# EAGLE design ihc_mon_orig (EAGLE 6.5.0)
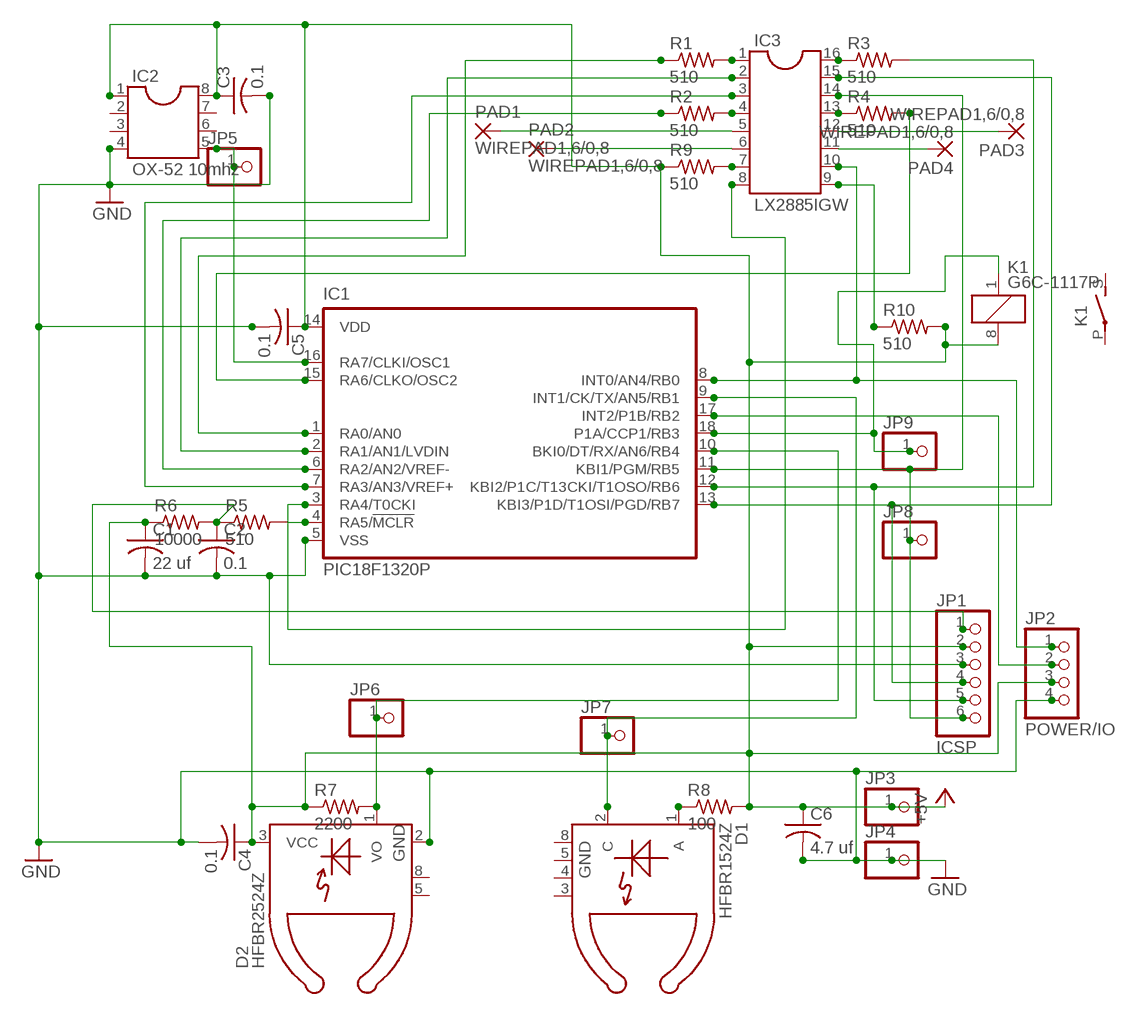
[diagram p0: schematic, sheet 1]

## Parts
C1  22 uf  C-US025-024X044  [C025-024X044]
C2  0.1  C-US050-025X075  [C050-025X075]
C3  0.1  C-US050-025X075  [C050-025X075]
C4  0.1  C-US050-025X075  [C050-025X075]
C5  0.1  C-US050-025X075  [C050-025X075]
C6  4.7 uf  C-US025-024X044  [C025-024X044]
D1  HFBR1524Z  HFBR1528  [HFBR25XX]
D2  HFBR2524Z  HFBR2528  [HFBR25XX]
IC1  PIC18F1320P  PIC18F1220P  [DIL18]
IC2  OX-52 10mhz  DIL8S  [SOCKET-08]
IC3  LX2885IGW  DIL16S  [SOCKET-16]
JP1  ICSP  PINHD-1X6  [1X06]
JP2  POWER/IO  PINHD-1X4  [1X04]
JP3  PINHD-1X1  [1X01]
JP4  PINHD-1X1  [1X01]
JP5  PINHD-1X1  [1X01]
JP6  PINHD-1X1  [1X01]
JP7  PINHD-1X1  [1X01]
JP8  PINHD-1X1  [1X01]
JP9  PINHD-1X1  [1X01]
K1  G6C-1117P  [G6C-1117P]
PAD1  WIREPAD1,6/0,8  [1,6/0,8]
PAD2  WIREPAD1,6/0,8  [1,6/0,8]
PAD3  WIREPAD1,6/0,8  [1,6/0,8]
PAD4  WIREPAD1,6/0,8  [1,6/0,8]
R1  510  R-US_0204/2V  [0204V]
R2  510  R-US_0204/2V  [0204V]
R3  510  R-US_0204/2V  [0204V]
R4  510  R-US_0204/2V  [0204V]
R5  510  R-US_0204/2V  [0204V]
R6  10000  R-US_0204/2V  [0204V]
R7  2200  R-US_0204/2V  [0204V]
R8  100  R-US_0204/2V  [0204V]
R9  510  R-US_0204/2V  [0204V]
R10  510  R-US_0204/2V  [0204V]

## Nets
+5V: C1.1 C3.1 C4.1 C5.1 C6.1 D2.3(VCC) IC1.14(VDD) IC2.1 IC2.8 JP1.2 JP2.3 JP3.1 K1.8 R6.1 R7.1 R8.2 R9.1 R10.2
GND: C1.2 C2.2 C3.2 C4.2 C5.2 C6.2 D2.2(GND) IC1.5(VSS) IC2.4 JP1.3 JP2.4 JP4.1
N$1: IC3.1 R1.2
N$2: IC3.4 R2.2
N$3: IC3.16 R3.1
N$4: IC3.13 R4.1
N$5: IC1.4(RA5/!MCLR) R5.2
N$6: C2.1 JP1.1 R5.1 R6.2
N$7: D2.1(VO) IC1.10(BKI0/DT/RX/AN6/RB4) JP6.1 R7.2
N$8: D1.1(A) R8.1
N$9: IC3.7 R9.2
N$10: IC1.18(P1A/CCP1/RB3) JP9.1 K1.1
N$11: IC1.8(INT0/AN4/RB0) IC3.10 JP2.1
N$12: IC3.9 R10.1
N$13: IC3.5 PAD1.1(P)
N$14: D1.2(C) IC1.9(INT1/CK/TX/AN5/RB1) JP7.1
N$15: IC1.11(KBI1/PGM/RB5) IC3.14 JP1.6 JP8.1
N$16: IC1.1(RA0/AN0) R1.1
N$17: IC1.2(RA1/AN1/LVDIN) IC3.2
N$18: IC1.6(RA2/AN2/VREF-) R2.1
N$19: IC1.7(RA3/AN3/VREF+) IC3.3
N$20: IC1.12(KBI2/P1C/T13CKI/T1OSO/RB6) JP1.5 R3.2
N$21: IC1.13(KBI3/P1D/T1OSI/PGD/RB7) IC3.15 JP1.4
N$22: IC1.15(RA6/CLKO/OSC2) R4.2
N$23: IC3.6 PAD2.1(P)
N$24: IC1.3(RA4/T0CKI) IC3.8
N$25: IC1.16(RA7/CLKI/OSC1) IC2.5 JP5.1
N$26: IC1.17(INT2/P1B/RB2) JP2.2
N$27: IC3.12 PAD3.1(P)
N$28: IC3.11 PAD4.1(P)
Unconnected: D1.3 D1.4 D1.5(GND) D1.8(GND) D2.5 D2.8 IC2.2 IC2.3 IC2.6 IC2.7 K1.P(2:P) K1.S(2:S)

## Library data of the parts
C1-C6 = resistor:C-US: CAPACITOR, American symbol
D1 = opto-transmittter-hp:HFBR1528: OPTO TRANSMITTER; MF: AGILENT TECHNOLOGIES; MPN: HFBR-1528; OC_FARNELL: 1247638; OC_NEWARK: 06F6056
D2 = opto-transmittter-hp:HFBR2528: OPTO RECEIVER; MF: AGILENT TECHNOLOGIES; MPN: HFBR-2528; OC_FARNELL: 1247664; OC_NEWARK: 06F6096
IC1 = microchip:PIC18F1*20: 18/20/28-Pin High-Performance, Enhanced Flash Microcontrollers with 10-bit A/D and nanoWatt Technology Source: ww1.microchip.com/downloads/en/DeviceDoc/39605c.pdf; MF: MICROCHIP; MPN: PIC18F1320-I/P; OC_FARNELL: 9761977; OC_NEWARK: 92C2429
IC2 = ic-package:DIL8: Dual In Line / Socket
IC3 = ic-package:DIL16: Dual In Line / Socket
JP1 = pinhead:PINHD-1X6: PIN HEADER
JP2 = pinhead:PINHD-1X4: PIN HEADER
JP3-JP9 = pinhead:PINHD-1X1: PIN HEADER
K1 = relay:G6C-1117P: RELAY 1 x norm. open, 10 A/240 V, Omron; OC_FARNELL: unknown; OC_NEWARK: unknown
PAD1-PAD4 = wirepad:WIREPAD: Wire PAD connect wire on PCB
R1-R10 = resistor:R-US_: RESISTOR, American symbol

## Board
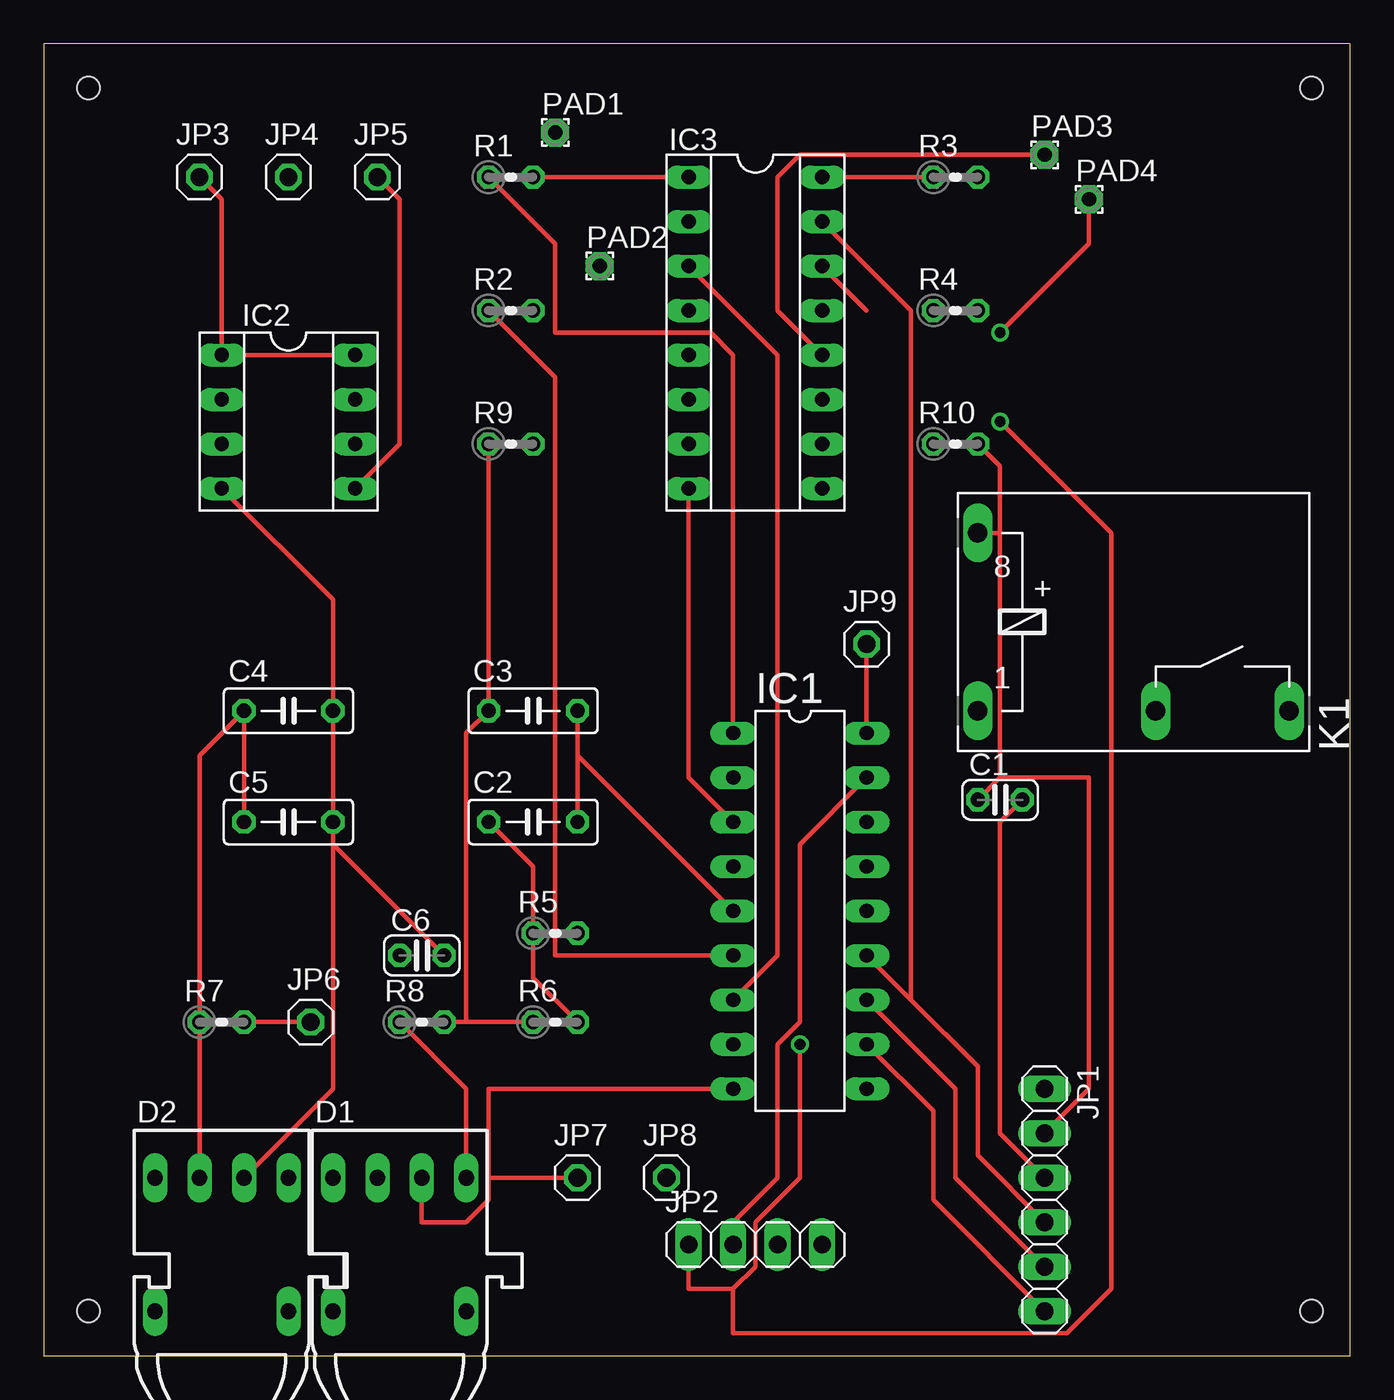
[diagram p1: board, top side]
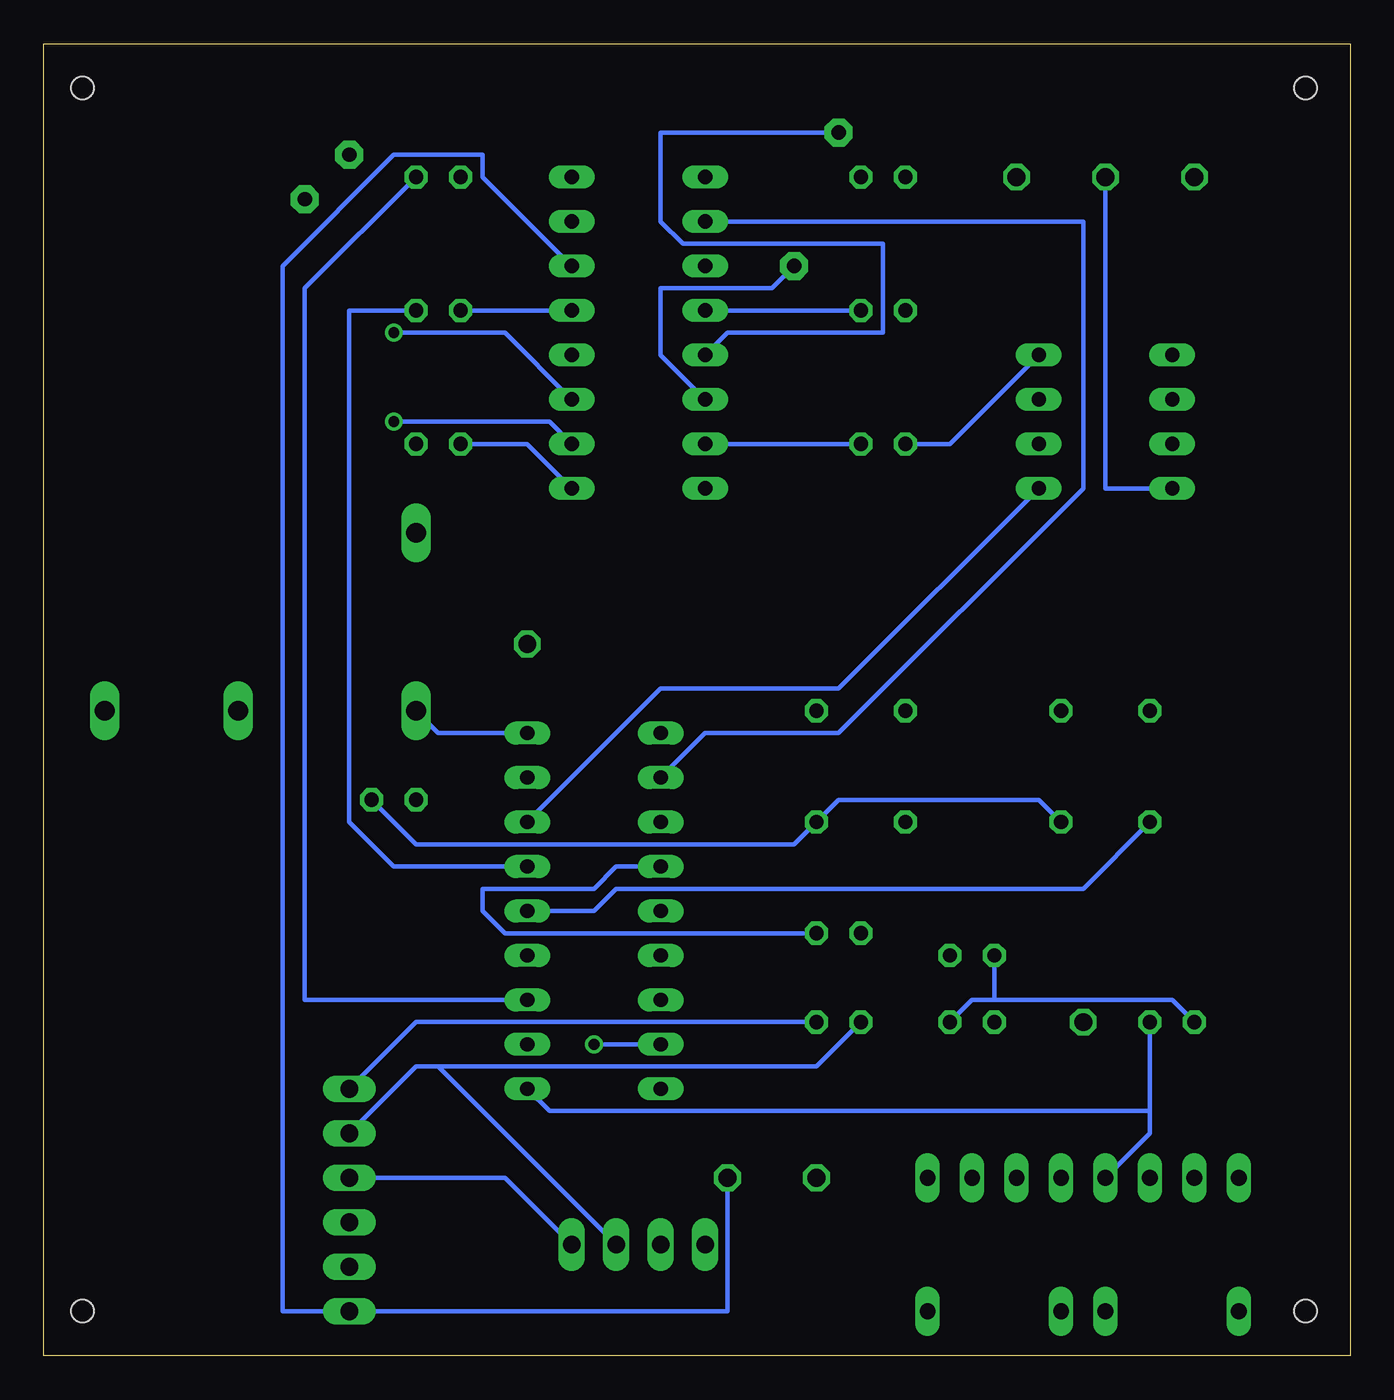
[diagram p2: board, bottom side, seen from below]

Size 74.6 x 74.92 mm. Coordinates in mm from the lower left corner, seen from the top.
Outline: 0,0 74.6,0 74.6,74.92 0,74.92 0,0
Copper layers (1*16): Top 0.035mm / dielectric 1.5mm / Bottom 0.035mm
Design rules "default": minimum track width 10mil, minimum drill 24mil, track to track 8mil, track to pad 8mil, pad to pad 8mil, via to via 8mil, smd to smd 8mil, copper to edge 40mil, drill to drill 8mil, minimum pad ring 10mil, minimum via ring 8mil, stop-mask expansion 4mil, vias tented up to drill 0mil, thermal gap 10mil
Holes 1.3 mm at 2.54,72.39 2.54,2.54 72.39,2.54 72.39,72.39

### Footprints (pad centres in the part's own frame; a part is rotated, then mirrored left to right if it is on the bottom)
C025-024X044 = drill 0.813 octagon: 1 -1.27,0; 2 1.27,0
C050-025X075 = drill 0.813 octagon: 1 -2.54,0; 2 2.54,0
HFBR25XX = drill 0.9 long: 1 0,3.81; 2 0,1.27; 3 0,-1.27; 4 0,-3.81; 5 7.62,-3.81; 8 7.62,3.81
DIL18 = drill 0.813 long: 1 -10.16,-3.81; 2 -7.62,-3.81; 3 -5.08,-3.81; 4 -2.54,-3.81; 5 0,-3.81; 6 2.54,-3.81; 7 5.08,-3.81; 8 7.62,-3.81; 9 10.16,-3.81; 10 10.16,3.81; 11 7.62,3.81; 12 5.08,3.81; 13 2.54,3.81; 14 0,3.81; 15 -2.54,3.81; 16 -5.08,3.81; 17 -7.62,3.81; 18 -10.16,3.81
SOCKET-08 = drill 0.813 long: 1 -3.81,-3.81; 2 -1.27,-3.81; 3 1.27,-3.81; 4 3.81,-3.81; 5 3.81,3.81; 6 1.27,3.81; 7 -1.27,3.81; 8 -3.81,3.81
SOCKET-16 = drill 0.813 long: 1 -8.89,-3.81; 2 -6.35,-3.81; 3 -3.81,-3.81; 4 -1.27,-3.81; 5 1.27,-3.81; 6 3.81,-3.81; 7 6.35,-3.81; 8 8.89,-3.81; 9 8.89,3.81; 10 6.35,3.81; 11 3.81,3.81; 12 1.27,3.81; 13 -1.27,3.81; 14 -3.81,3.81; 15 -6.35,3.81; 16 -8.89,3.81
1X06 = drill 1.016 long: 1 -6.35,0; 2 -3.81,0; 3 -1.27,0; 4 1.27,0; 5 3.81,0; 6 6.35,0
1X04 = drill 1.016 long: 1 -3.81,0; 2 -1.27,0; 3 1.27,0; 4 3.81,0
1X01 = drill 1.016 octagon: 1 0,0
G6C-1117P = drill 1.118 long: 1 -8.89,-5.08; 8 -8.89,5.08; P 1.27,-5.08; S 8.89,-5.08
1,6/0,8 = drill 0.813 pad 1.6 octagon: 1 0,0
0204V = drill 0.813 octagon: 1 -1.27,0; 2 1.27,0

### Placement (x,y rotation side)
C1  54.61,31.75 0 top
C2  27.94,30.48 0 top
C3  27.94,36.83 0 top
C4  13.97,36.83 0 top
C5  13.97,30.48 0 top
C6  21.59,22.86 0 top
D1  20.32,10.16 270 top
D2  10.16,10.16 270 top
IC1  43.18,25.4 270 top
IC2  13.97,53.34 270 top
IC3  40.64,58.42 270 top
JP1  57.15,8.89 270 top
JP2  40.64,6.35 0 top
JP3  8.89,67.31 0 top
JP4  13.97,67.31 0 top
JP5  19.05,67.31 0 top
JP6  15.24,19.05 0 top
JP7  30.48,10.16 0 top
JP8  35.56,10.16 0 top
JP9  46.99,40.64 0 top
K1  62.23,41.91 0 top
PAD1  29.21,69.85 0 top
PAD2  31.75,62.23 0 top
PAD3  57.15,68.58 0 top
PAD4  59.69,66.04 0 top
R1  26.67,67.31 0 top
R2  26.67,59.69 0 top
R3  52.07,67.31 0 top
R4  52.07,59.69 0 top
R5  29.21,24.13 0 top
R6  29.21,19.05 0 top
R7  10.16,19.05 0 top
R8  21.59,19.05 0 top
R9  26.67,52.07 0 top
R10  52.07,52.07 0 top

### Tracks (layer width: path | path; a pad name or v marks a point on that pad's centre or on a via)
+5V
  Top 0.254: IC2.8 IC2.1 10.16,66.04 JP3.1 | R9.1 C3.1 24.13,35.56 24.13,19.05 | 54.61,33.02 C1.1 | 54.61,33.02 59.69,33.02 59.69,15.24 JP1.2 | R6.1 24.13,19.05 | 24.13,19.05 R8.2 | D2.3 R7.1 8.89,34.29 C4.1 C5.1 | R10.2 54.61,50.8 54.61,46.99 | 54.61,33.02 54.61,46.99 | 54.61,46.99 K1.8
  Bottom 0.254: C5.1 15.24,26.67 41.91,26.67 43.18,25.4 IC1.14 | IC2.8 22.86,52.07 R9.1 | R8.2 21.59,20.32 20.32,20.32 | 20.32,20.32 10.16,20.32 R7.1 | JP1.2 53.34,16.51 52.07,16.51 | 52.07,16.51 30.48,16.51 R6.1 | 52.07,16.51 JP2.3 | 20.32,20.32 C6.1
GND
  Top 0.254: C1.2 54.61,30.48 54.61,12.7 JP1.3 | C3.2 30.48,34.29 | 30.48,34.29 C2.2 | 30.48,34.29 IC1.5 | IC2.4 16.51,43.18 C4.2 C5.2 16.51,29.21 | D2.2 16.51,15.24 16.51,29.21 | 16.51,29.21 C6.2
  Bottom 0.254: C5.2 17.78,31.75 29.21,31.75 C2.2 31.75,29.21 53.34,29.21 C1.2 | JP2.4 48.26,10.16 JP1.3 | JP4.1 13.97,49.53 IC2.4
N$1
  Top 0.254: IC3.1 R1.2
N$2
  Bottom 0.254: IC3.4 R2.2
N$3
  Top 0.254: R3.1 IC3.16
N$4
  Bottom 0.254: R4.1 IC3.13
N$5
  Bottom 0.254: R5.2 48.26,24.13 49.53,25.4 49.53,26.67 43.18,26.67 41.91,27.94 IC1.4
N$6
  Top 0.254: R6.2 27.94,21.59 R5.1 27.94,27.94 C2.1
  Bottom 0.254: JP1.1 53.34,19.05 R6.2
N$7
  Top 0.254: R7.2 JP6.1
  Bottom 0.254: 11.43,13.97 11.43,12.7 D2.1 | 11.43,13.97 R7.2 | IC1.10 45.72,13.97 11.43,13.97
N$8
  Top 0.254: R8.1 24.13,15.24 D1.1
N$9
  Bottom 0.254: IC3.7 R9.2
N$10
  Top 0.254: JP9.1 IC1.18
  Bottom 0.254: K1.1 52.07,35.56 IC1.18
N$11  (via drill 0.61)
  Top 0.254: v43.18,17.78 43.18,10.16 40.64,7.62 40.64,5.08 39.37,3.81 | 39.37,3.81 36.83,3.81 JP2.1 | v54.61,53.34 60.96,46.99 60.96,3.81 58.42,1.27 39.37,1.27 39.37,3.81
  Bottom 0.254: v43.18,17.78 IC1.8 | IC3.10 45.72,53.34 v54.61,53.34
N$12
  Bottom 0.254: IC3.9 46.99,52.07 R10.1
N$13
  Bottom 0.254: IC3.5 35.56,58.42 26.67,58.42 26.67,63.5 38.1,63.5 39.37,64.77 39.37,69.85 PAD1.1
N$14
  Top 0.254: IC1.9 25.4,15.24 25.4,10.16 | 25.4,10.16 25.4,8.89 24.13,7.62 21.59,7.62 D1.2 | 25.4,10.16 JP7.1
N$15
  Top 0.254: IC1.11 50.8,13.97 50.8,8.89 JP1.6 | IC3.14 46.99,59.69
  Bottom 0.254: JP8.1 35.56,2.54 JP1.6 60.96,2.54 60.96,62.23 54.61,68.58 49.53,68.58 49.53,67.31 IC3.14
N$16
  Top 0.254: IC1.1 39.37,57.15 38.1,58.42 29.21,58.42 29.21,63.5 R1.1
N$17
  Bottom 0.254: IC1.2 36.83,35.56 29.21,35.56 15.24,49.53 15.24,64.77 IC3.2
N$18
  Top 0.254: IC1.6 29.21,22.86 29.21,55.88 R2.1
N$19
  Top 0.254: IC1.7 41.91,22.86 41.91,57.15 IC3.3
N$20
  Top 0.254: IC1.12 52.07,15.24 52.07,10.16 JP1.5
  Bottom 0.254: R3.2 59.69,60.96 59.69,20.32 IC1.12
N$21
  Top 0.254: 49.53,20.32 53.34,16.51 53.34,11.43 JP1.4 | 49.53,20.32 IC1.13 | IC3.15 49.53,59.69 49.53,20.32
N$22
  Bottom 0.254: IC1.15 54.61,27.94 57.15,30.48 57.15,59.69 R4.2
N$23
  Bottom 0.254: IC3.6 39.37,57.15 39.37,60.96 33.02,60.96 PAD2.1
N$24
  Top 0.254: IC1.3 36.83,33.02 IC3.8
N$25
  Top 0.254: JP5.1 20.32,66.04 20.32,52.07 IC2.5
  Bottom 0.254: IC2.5 29.21,38.1 39.37,38.1 IC1.16
N$26
  Top 0.254: IC1.17 43.18,29.21 43.18,19.05 41.91,17.78 41.91,10.16 39.37,7.62 JP2.2
N$27
  Top 0.254: IC3.12 41.91,59.69 41.91,67.31 43.18,68.58 PAD3.1
N$28  (via drill 0.61)
  Top 0.254: v54.61,58.42 59.69,63.5 PAD4.1
  Bottom 0.254: IC3.11 48.26,58.42 v54.61,58.42